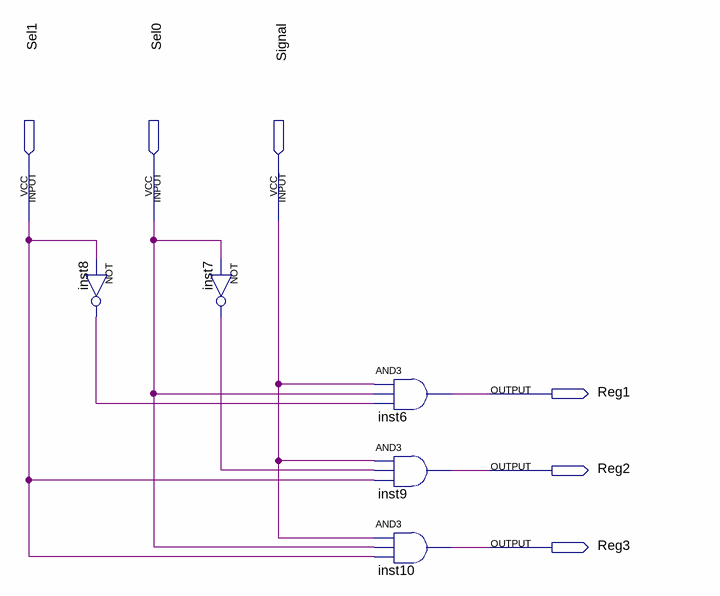
[diagram p0: schematic sheet]
// Quartus schematic RegMux.bdf as structural Verilog: 5 symbols, 6 pins
module RegMux (
  input  Sel1,
  input  Sel0,
  input  Signal,
  output Reg1,
  output Reg2,
  output Reg3
);

  wire inst7_out, inst8_out;

  not inst8 (inst8_out, Sel1);
  not inst7 (inst7_out, Sel0);
  and inst6 (Reg1, Signal, Sel0, inst8_out);
  and inst9 (Reg2, Signal, inst7_out, Sel1);
  and inst10 (Reg3, Signal, Sel0, Sel1);
endmodule
